# EAGLE design IMU_MCU_AUD_PT (EAGLE 6.5.0)

## Sheet 1 of 4
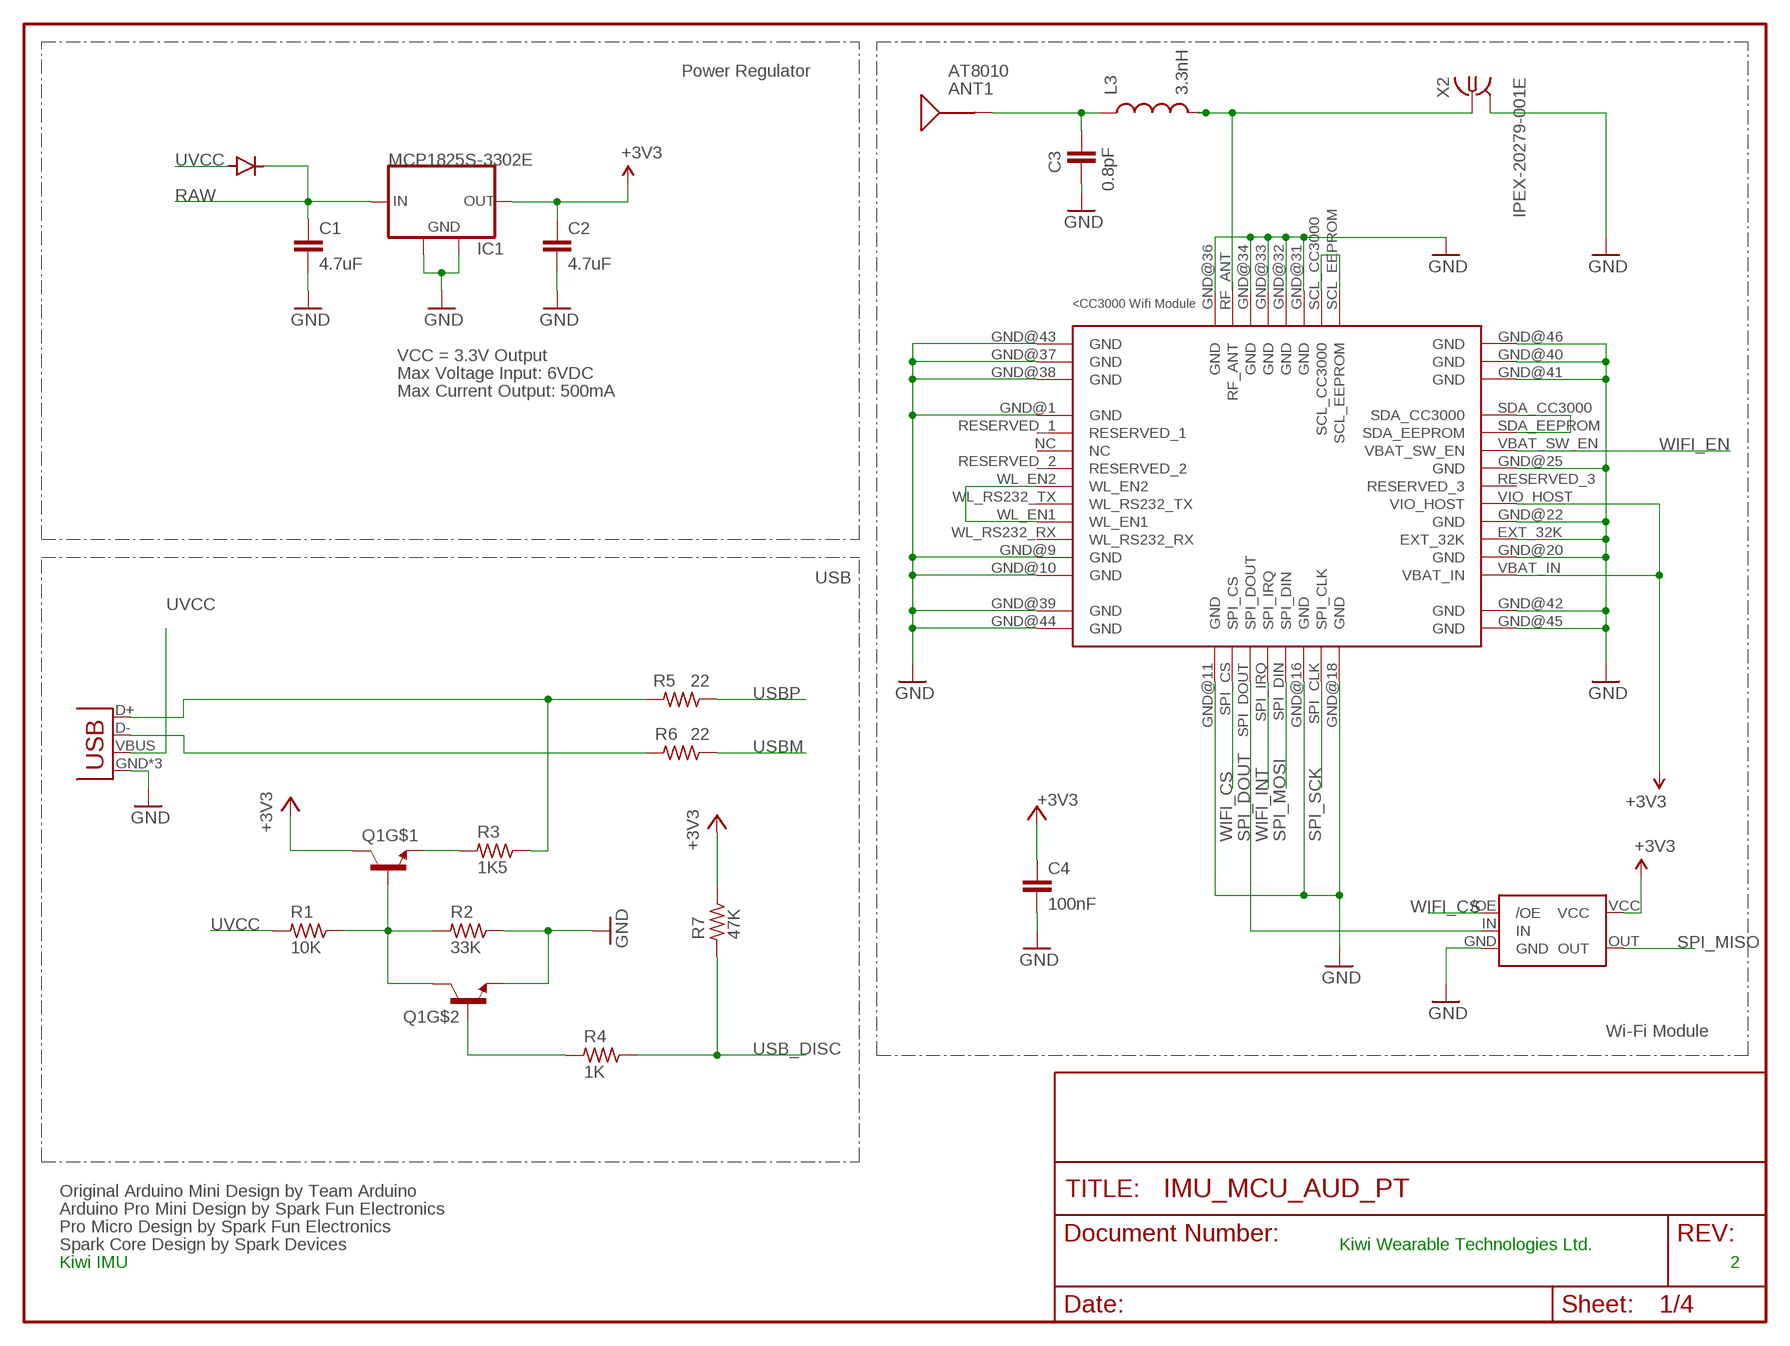
[diagram p0: schematic, sheet 1, part 1 of 2]
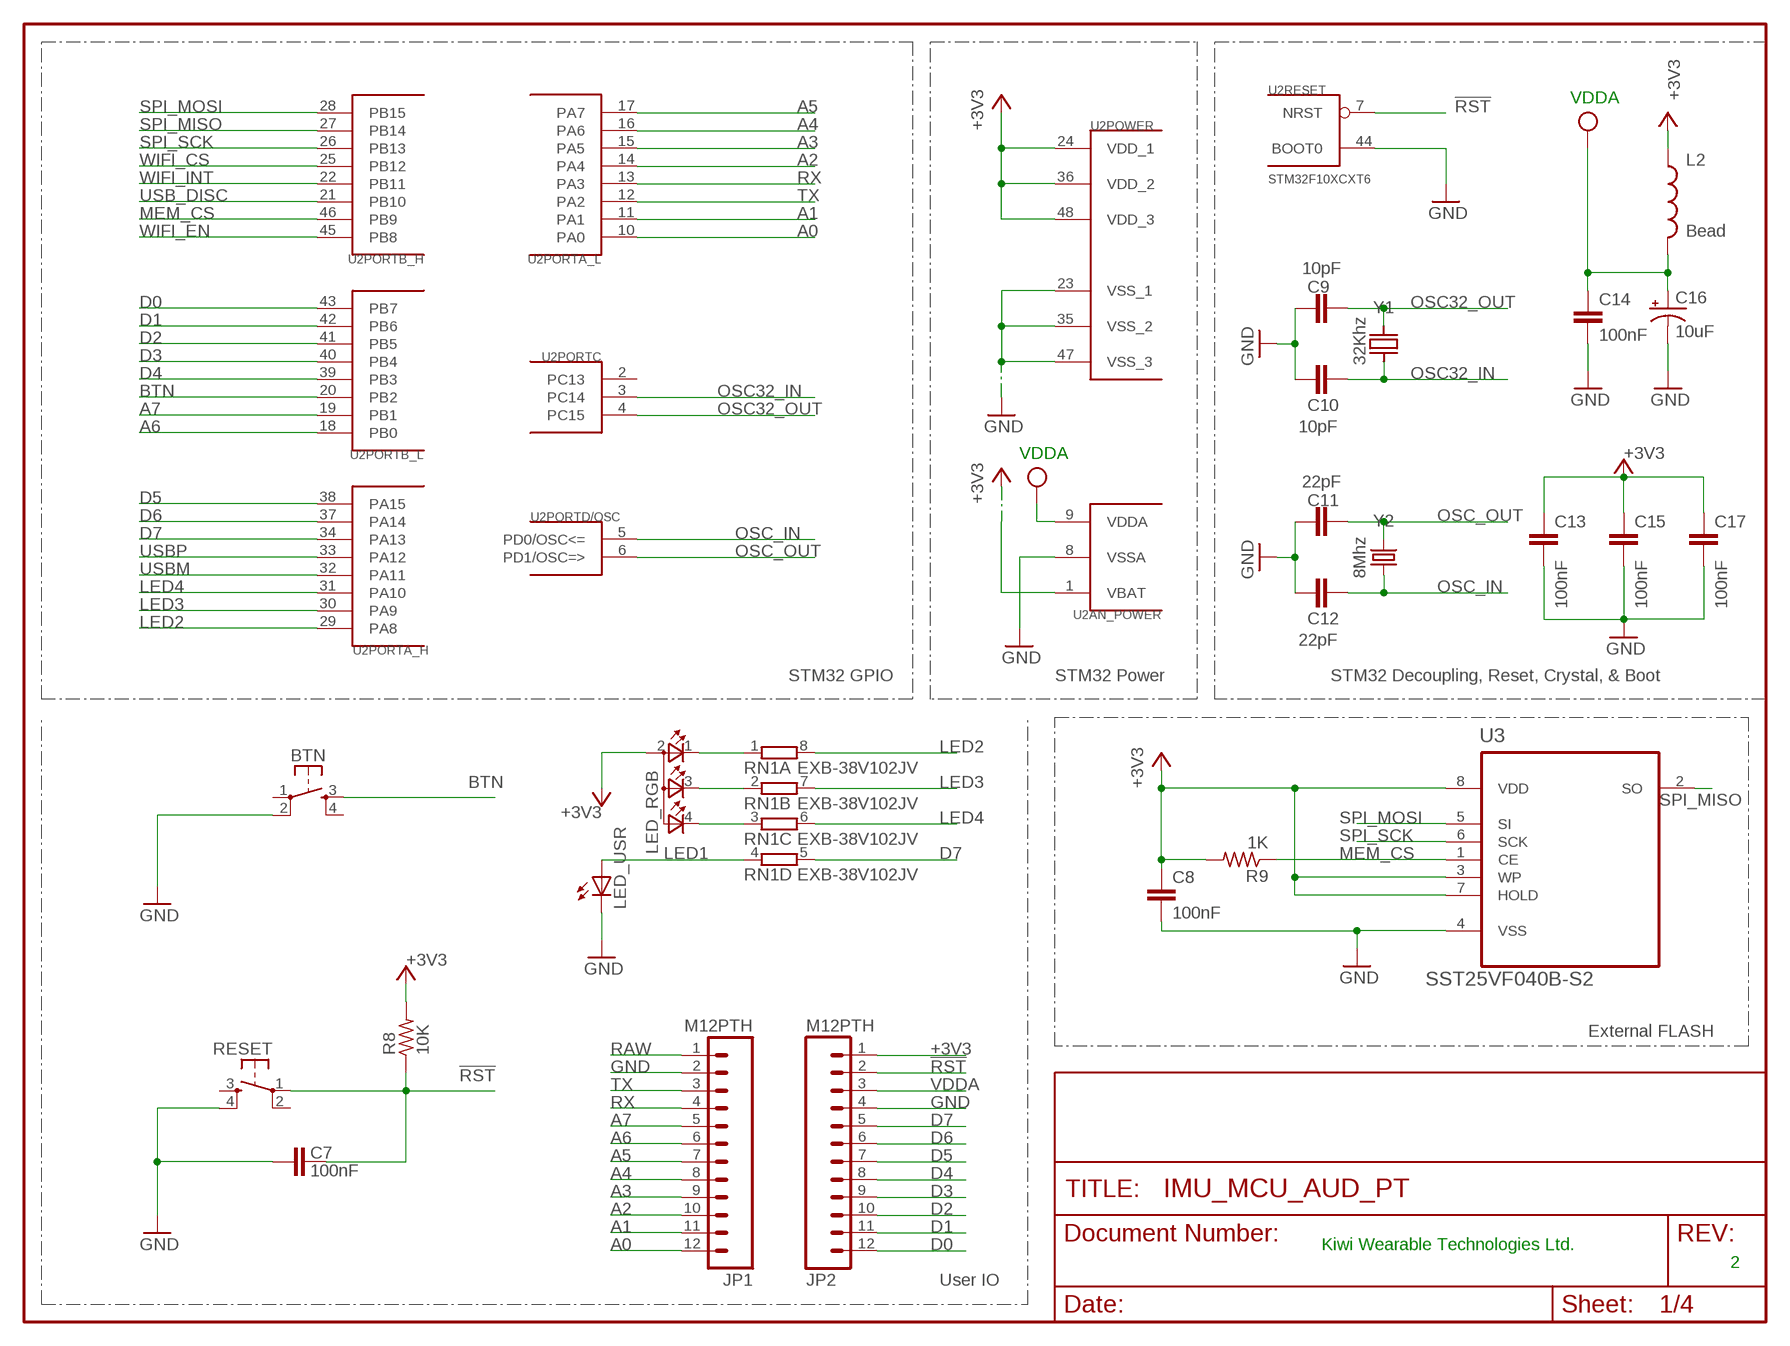
[diagram p1: schematic, sheet 1, part 2 of 2]

### Parts
ANT1  AT8010  [AT8010]
B1  NL17SZ125SOT553  [SOT-553]
BTN  KMR211GLFS  TAC_SWITCHSMD  [TACTILE_SWITCH_SMD]
C1  4.7uF  C-EUC0603  [C0603]
C2  4.7uF  C-EUC0603  [C0603]
C3  0.8pF  C-EUC0603  [C0603]
C4  100nF  C-EUC0603  [C0603]
C7  100nF  C-EUC0603  [C0603]
C8  100nF  C-EUC0603  [C0603]
C9  10pF  C-EUC0603  [C0603]
C10  10pF  C-EUC0603  [C0603]
C11  22pF  C-EUC0603  [C0603]
C12  22pF  C-EUC0603  [C0603]
C13  100nF  C-EUC0603  [C0603]
C14  100nF  C-EUC0603  [C0603]
C15  100nF  C-EUC0603  [C0603]
C16  10uF  TANT-CAP1206  [EIA3216]
C17  100nF  C-EUC0603  [C0603]
IC1  MCP1825S-3302E  MCP1825S-SOT223  [SOT223]
JP1  M12PTH  [1X12-SMALL-PADS]
JP2  M12PTH  [1X12-SMALL-PADS]
L2  Bead  INDUCTOR0603  [0603]
L3  3.3nH  INDUCTOR0603  [0603]
LED_RGB  TOPLED-3PLCC  [P-LCC-4-3]
LED_USR  LED0603  [LED-0603]
Q1  MMDT3904  [SOT363]
R1  10K  R-US_R0603  [R0603]
R2  33K  R-US_R0603  [R0603]
R3  1K5  R-US_R0603  [R0603]
R4  1K  R-US_R0603  [R0603]
R5  22  R-US_R0603  [R0603]
R6  22  R-US_R0603  [R0603]
R7  47K  R-US_R0603  [R0603]
R8  10K  R-US_R0603  [R0603]
R9  1K  R-US_R0603  [R0603]
RESET  KMR211GLFS  TAC_SWITCHSMD  [TACTILE_SWITCH_SMD]
RN1  EXB-38V102JV  4R-NEXB38V  [EXB38V]
U1  CC3000  [CC3000]
U2  STM32F10XCXT6  [TQFP48]
U3  SST25VF040B-S2  [SOIC127P790X216-8N]
U$3  DIODE  [DIODE-DO-220AA(SMP)]
X1  USB-MICROB  USBUSB-MICROB-SLOT-HOLE  [USB-MICROB-SLOT-HOLE]
X2  IPEX-20279-001E  [IPEX-20279-001E]
Y1  32Khz  Q_FC135  [FC135]
Y2  8Mhz  CRYSTAL5X3  [CRYSTAL-SMD-5X3]

### Nets
3.3V: B1.VCC ; supply symbol labelled +3V3
!RST: C7.2 JP2.2 R8.1 RESET.1 U2.7(RESET:NRST)
+3V3: C2.1 C4.1 C8.1 C13.1 C15.1 C17.1 IC1.3(OUT) JP2.1 L2.1 LED_RGB.2(A2) Q1.3(C) R7.1 R8.2 R9.2 U1.VBAT_IN U1.VIO_HOST U2.1(AN_POWER:VBAT) U2.24(POWER:VDD_1) U2.36(POWER:VDD_2) U2.48(POWER:VDD_3) U3.3(WP) U3.7(HOLD) U3.8(VDD) ; also sheet 2,3,4
A0: JP1.12 U2.10(PORTA_L:PA0) ; also sheet 3
A1: JP1.11 U2.11(PORTA_L:PA1) ; also sheet 3
A2: JP1.10 U2.14(PORTA_L:PA4)
A3: JP1.9 U2.15(PORTA_L:PA5)
A4: JP1.8 U2.16(PORTA_L:PA6)
A5: JP1.7 U2.17(PORTA_L:PA7)
A6: JP1.6 U2.18(PORTB_L:PB0) ; also sheet 2
A7: JP1.5 U2.19(PORTB_L:PB1)
BTN: BTN.3 U2.20(PORTB_L:PB2)
D0: JP2.12 U2.43(PORTB_L:PB7) ; also sheet 2
D1: JP2.11 U2.42(PORTB_L:PB6) ; also sheet 2
D2: JP2.10 U2.41(PORTB_L:PB5)
D3: JP2.9 U2.40(PORTB_L:PB4) ; also sheet 4
D4: JP2.8 U2.39(PORTB_L:PB3) ; also sheet 4
D5: JP2.7 U2.38(PORTA_H:PA15) ; also sheet 4
D6: JP2.6 U2.37(PORTA_H:PA14) ; also sheet 4
D7: JP2.5 RN1.5 U2.34(PORTA_H:PA13)
GND [vcc]: B1.GND BTN.2 C1.2 C2.2 C3.1 C4.2 C7.1 C8.2 C9.2 C10.2 C11.2 C12.2 C13.2 C14.2 C15.2 C16.C(-) C17.2 IC1.2(GND) IC1.4(GND) JP1.2 JP2.4 LED_USR.C Q1.1(E) R2.1 RESET.4 U1.EXT_32K U1.GND@1(GND) U1.GND@9(GND) U1.GND@10(GND) U1.GND@11(GND) U1.GND@16(GND) U1.GND@18(GND) U1.GND@20(GND) U1.GND@22(GND) U1.GND@25(GND) U1.GND@31(GND) U1.GND@32(GND) U1.GND@33(GND) U1.GND@34(GND) U1.GND@36(GND) U1.GND@37(GND) U1.GND@38(GND) U1.GND@39(GND) U1.GND@40(GND) U1.GND@41(GND) U1.GND@42(GND) U1.GND@43(GND) U1.GND@44(GND) U1.GND@45(GND) U1.GND@46(GND) U2.8(AN_POWER:VSSA) U2.23(POWER:VSS_1) U2.35(POWER:VSS_2) U2.44(RESET:BOOT0) U2.47(POWER:VSS_3) U3.4(VSS) X1.GND X1.MT1(GND) X1.MT2(GND) X2.2@1(GND) X2.2@2(GND) ; also sheet 2,3,4
LED1: LED_USR.A RN1.4
LED2: RN1.8 U2.29(PORTA_H:PA8)
LED3: RN1.7 U2.30(PORTA_H:PA9)
LED4: RN1.6 U2.31(PORTA_H:PA10)
MEM_CS: R9.1 U2.46(PORTB_H:PB9) U3.1(CE)
N$1: R3.1 R5.2 X1.D+
N$3 [RF]: ANT1.SIG(SIGNAL) C3.2 L3.1
N$4 [RF]: L3.2 U1.RF_ANT X2.1
N$6: R6.2 X1.D-
N$7: U1.SCL_CC3000 U1.SCL_EEPROM
N$8: Q1.2(B) R4.2
N$9: U1.WL_EN1 U1.WL_EN2
N$10: LED_RGB.1(CRED) RN1.1
N$12: LED_RGB.3(CBLUE) RN1.2
N$13: Q1.5(B) Q1.6(C) R1.1 R2.2
N$14: LED_RGB.4(CGREEN) RN1.3
N$15: U1.SDA_CC3000 U1.SDA_EEPROM
N$16: Q1.4(E) R3.2
OSC32_IN: C10.1 U2.3(PORTC:PC14) Y1.X1
OSC32_OUT: C9.1 U2.4(PORTC:PC15) Y1.X2
OSC_IN: C12.1 U2.5(PORTD/OSC:PD0/OSC<=) Y2.1
OSC_OUT: C11.1 U2.6(PORTD/OSC:PD1/OSC=>) Y2.3
RAW [vcc]: C1.1 IC1.1(IN) JP1.1 U$3.CATHODE
RX: JP1.4 U2.13(PORTA_L:PA3)
SPI_DOUT: B1.IN U1.SPI_DOUT
SPI_MISO: B1.OUT U2.27(PORTB_H:PB14) U3.2(SO)
SPI_MOSI: U1.SPI_DIN U2.28(PORTB_H:PB15) U3.5(SI)
SPI_SCK: U1.SPI_CLK U2.26(PORTB_H:PB13) U3.6(SCK)
TX: JP1.3 U2.12(PORTA_L:PA2)
USB_DISC: R4.1 R7.2 U2.21(PORTB_H:PB10)
USBM: R6.1 U2.32(PORTA_H:PA11)
USBP: R5.1 U2.33(PORTA_H:PA12)
UVCC: R1.2 U$3.ANODE X1.VBUS
VDDA: C14.1 C16.A(+) JP2.3 L2.2 U2.9(AN_POWER:VDDA) ; supply symbol labelled VCC
WIFI_CS: B1./OE U1.SPI_CS U2.25(PORTB_H:PB12)
WIFI_EN: U1.VBAT_SW_EN U2.45(PORTB_H:PB8)
WIFI_INT: U1.SPI_IRQ U2.22(PORTB_H:PB11)
Unconnected: BTN.1 BTN.4 RESET.2 RESET.3 U1.NC U1.RESERVED_1 U1.RESERVED_2 U1.RESERVED_3 U1.WL_RS232_RX U1.WL_RS232_TX U2.2(PORTC:PC13)

### Notes on the sheet
- Power Regulator
- VDDA
- VCC = 3.3V Output
- Max Voltage Input: 6VDC
- Max Current Output: 500mA
- VDDA
- USB
- STM32 GPIO | STM32 Power | STM32 Decoupling, Reset, Crystal, & Boot
- Wi-Fi Module | External FLASH
- Original Arduino Mini Design by Team Arduino
- Arduino Pro Mini Design by Spark Fun Electronics
- Pro Micro Design by Spark Fun Electronics
- Spark Core Design by Spark Devices | Kiwi Wearable Technologies Ltd. | Kiwi Wearable Technologies Ltd.
- Kiwi IMU | 2 | 2
- User IO

## Sheet 2 of 4
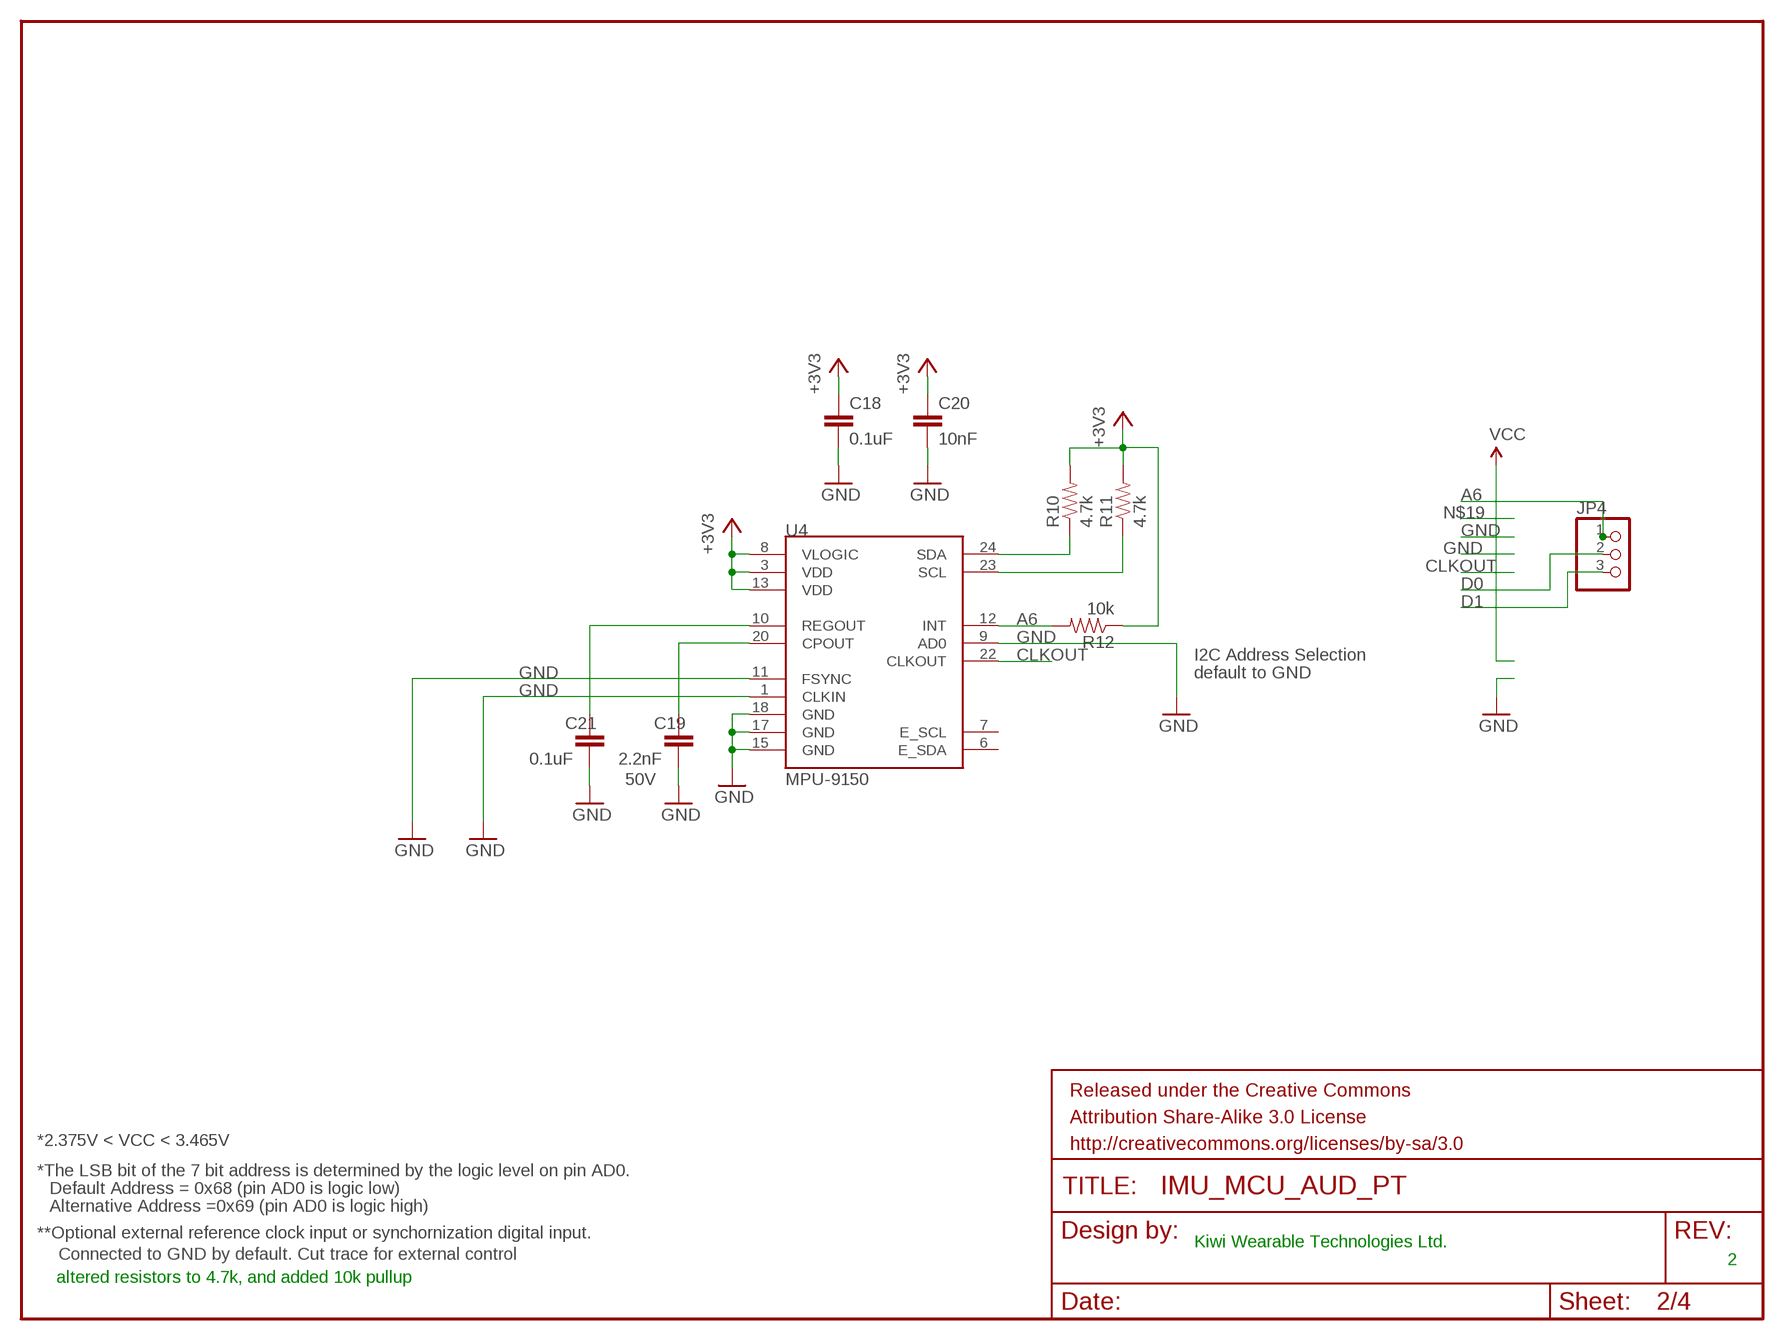
[diagram p2: schematic, sheet 2]

### Parts
C18  0.1uF  CAP0402-CAP  [0402-CAP]
C19  2.2nF  CAP0402-CAP  [0402-CAP]
C20  10nF  CAP0402-CAP  [0402-CAP]
C21  0.1uF  CAP0402-CAP  [0402-CAP]
JP4  PINHD-1X3  [1X03]
R10  4.7k  RESISTOR0402-RES  [0402-RES]
R11  4.7k  RESISTOR0402-RES  [0402-RES]
R12  10k  RESISTOR0402-RES  [0402-RES]
U4  MPU-9150  MPU-9150QFN-24-NP  [QFN-24-NP]

### Nets
+3V3: C18.1 C20.1 R10.2 R11.2 R12.1 U4.3(VDD) U4.8(VLOGIC) U4.13(VDD) ; also sheet 1,3,4
A6: JP4.1 R12.2 U4.12(INT) ; also sheet 1
CLKOUT: U4.22(CLKOUT)
D0: JP4.2 R10.1 U4.24(SDA) ; also sheet 1
D1: JP4.3 R11.1 U4.23(SCL) ; also sheet 1
GND [vcc]: C18.2 C19.2 C20.2 C21.2 U4.1(CLKIN) U4.9(AD0) U4.11(FSYNC) U4.15(GND) U4.17(GND) U4.18(GND) ; also sheet 1,3,4
N$17: C19.1 U4.20(CPOUT)
N$18: C21.1 U4.10(REGOUT)
Unconnected: U4.6(E_SDA) U4.7(E_SCL)

### Notes on the sheet
- I2C Address Selection
- default to GND
- 50V
- *2.375V < VCC < 3.465V
- *The LSB bit of the 7 bit address is determined by the logic level on pin AD0.
- Default Address = 0x68 (pin AD0 is logic low)
- Alternative Address =0x69 (pin AD0 is logic high)
- **Optional external reference clock input or synchornization digital input.
- Kiwi Wearable Technologies Ltd.
- Connected to GND by default. Cut trace for external control
- 2
- altered resistors to 4.7k, and added 10k pullup

## Sheet 3 of 4
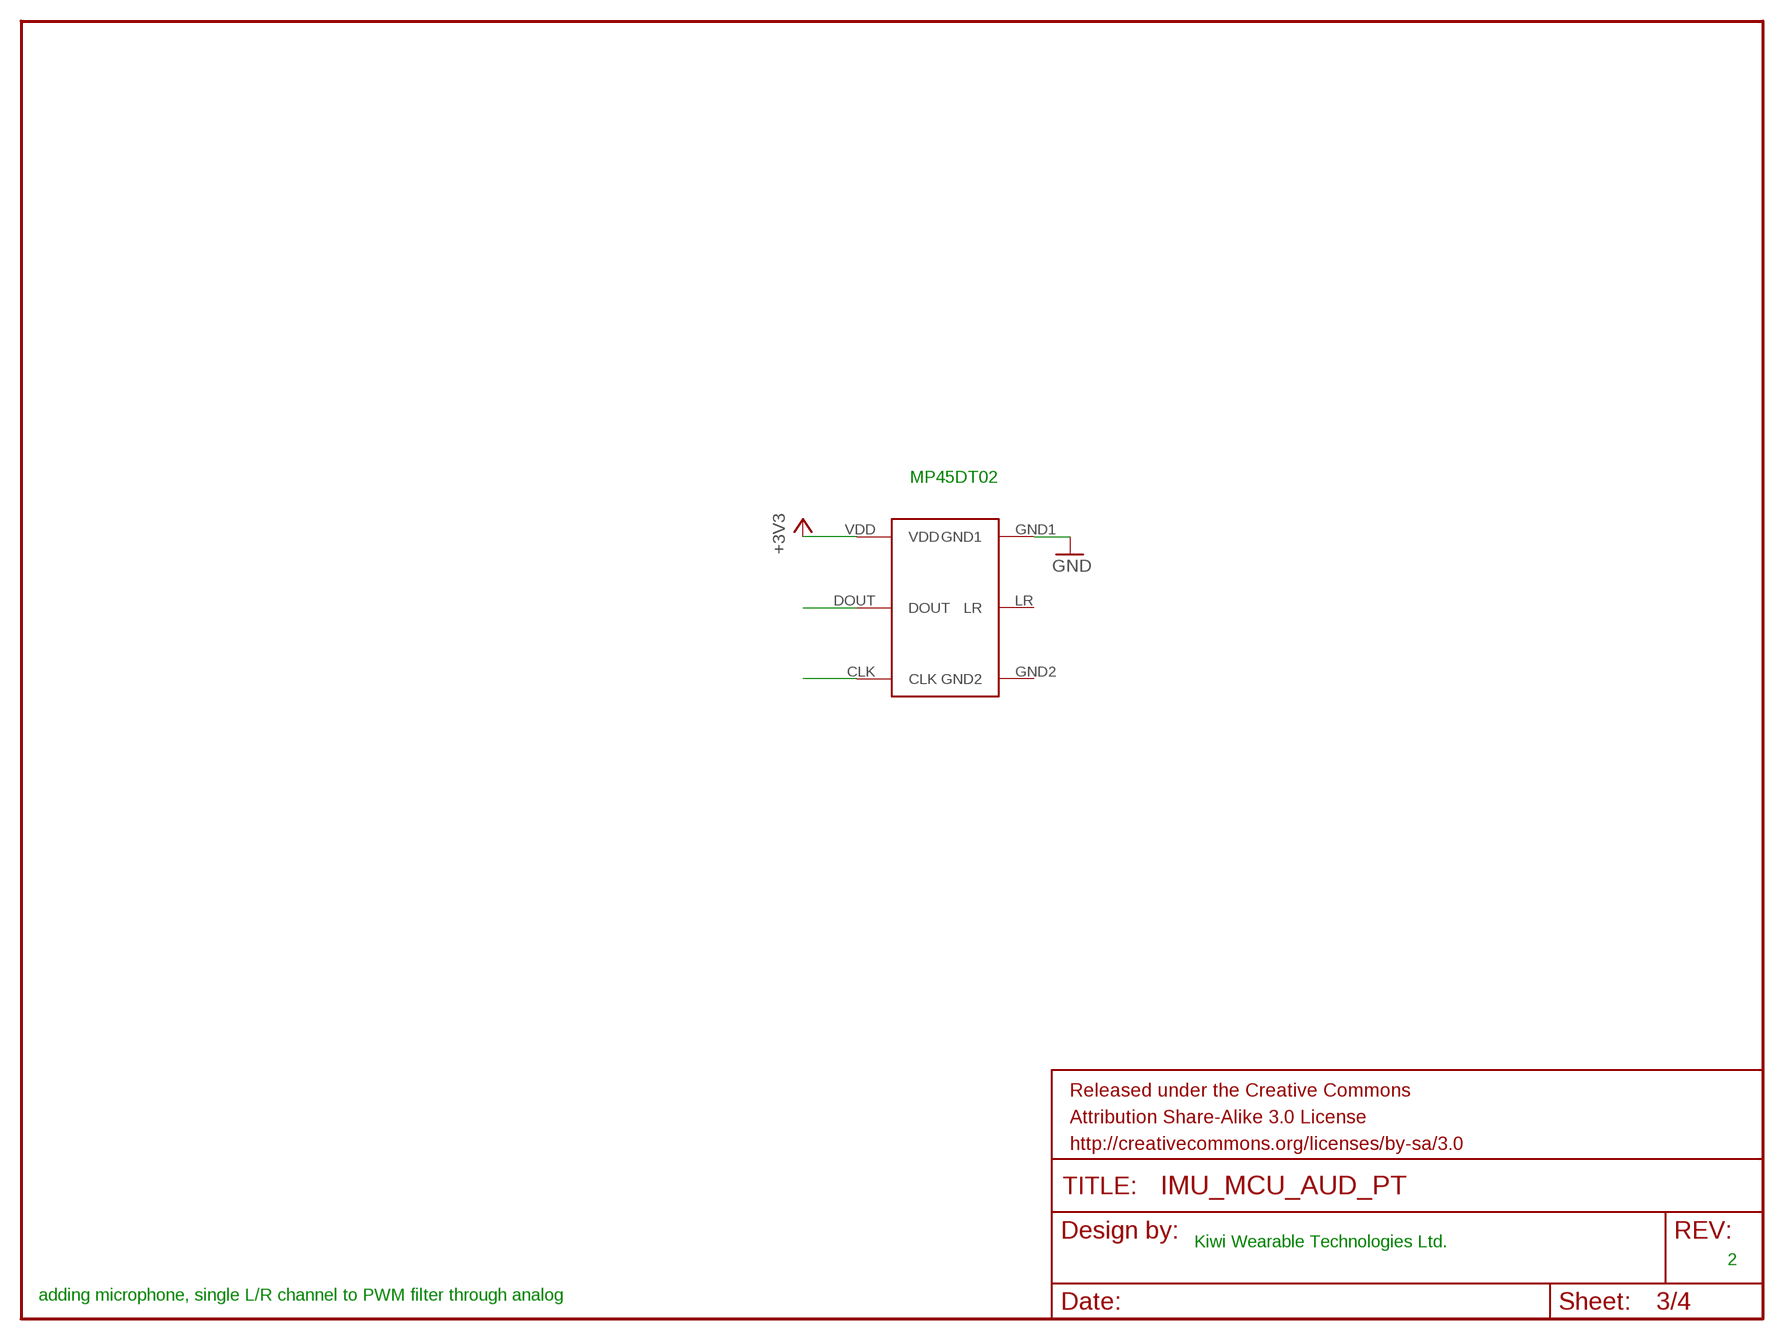
[diagram p3: schematic, sheet 3]

### Parts
M1  MP45DT02  [HLGA]

### Nets
+3V3: M1.VDD ; also sheet 1,2,4
A0: M1.CLK ; also sheet 1
A1: M1.DOUT ; also sheet 1
GND [vcc]: M1.GND1 ; also sheet 1,2,4
Unconnected: M1.GND2 M1.LR

### Notes on the sheet
- MP45DT02
- Kiwi Wearable Technologies Ltd.
- 2
- adding microphone, single L/R channel to PWM filter through analog

## Sheet 4 of 4
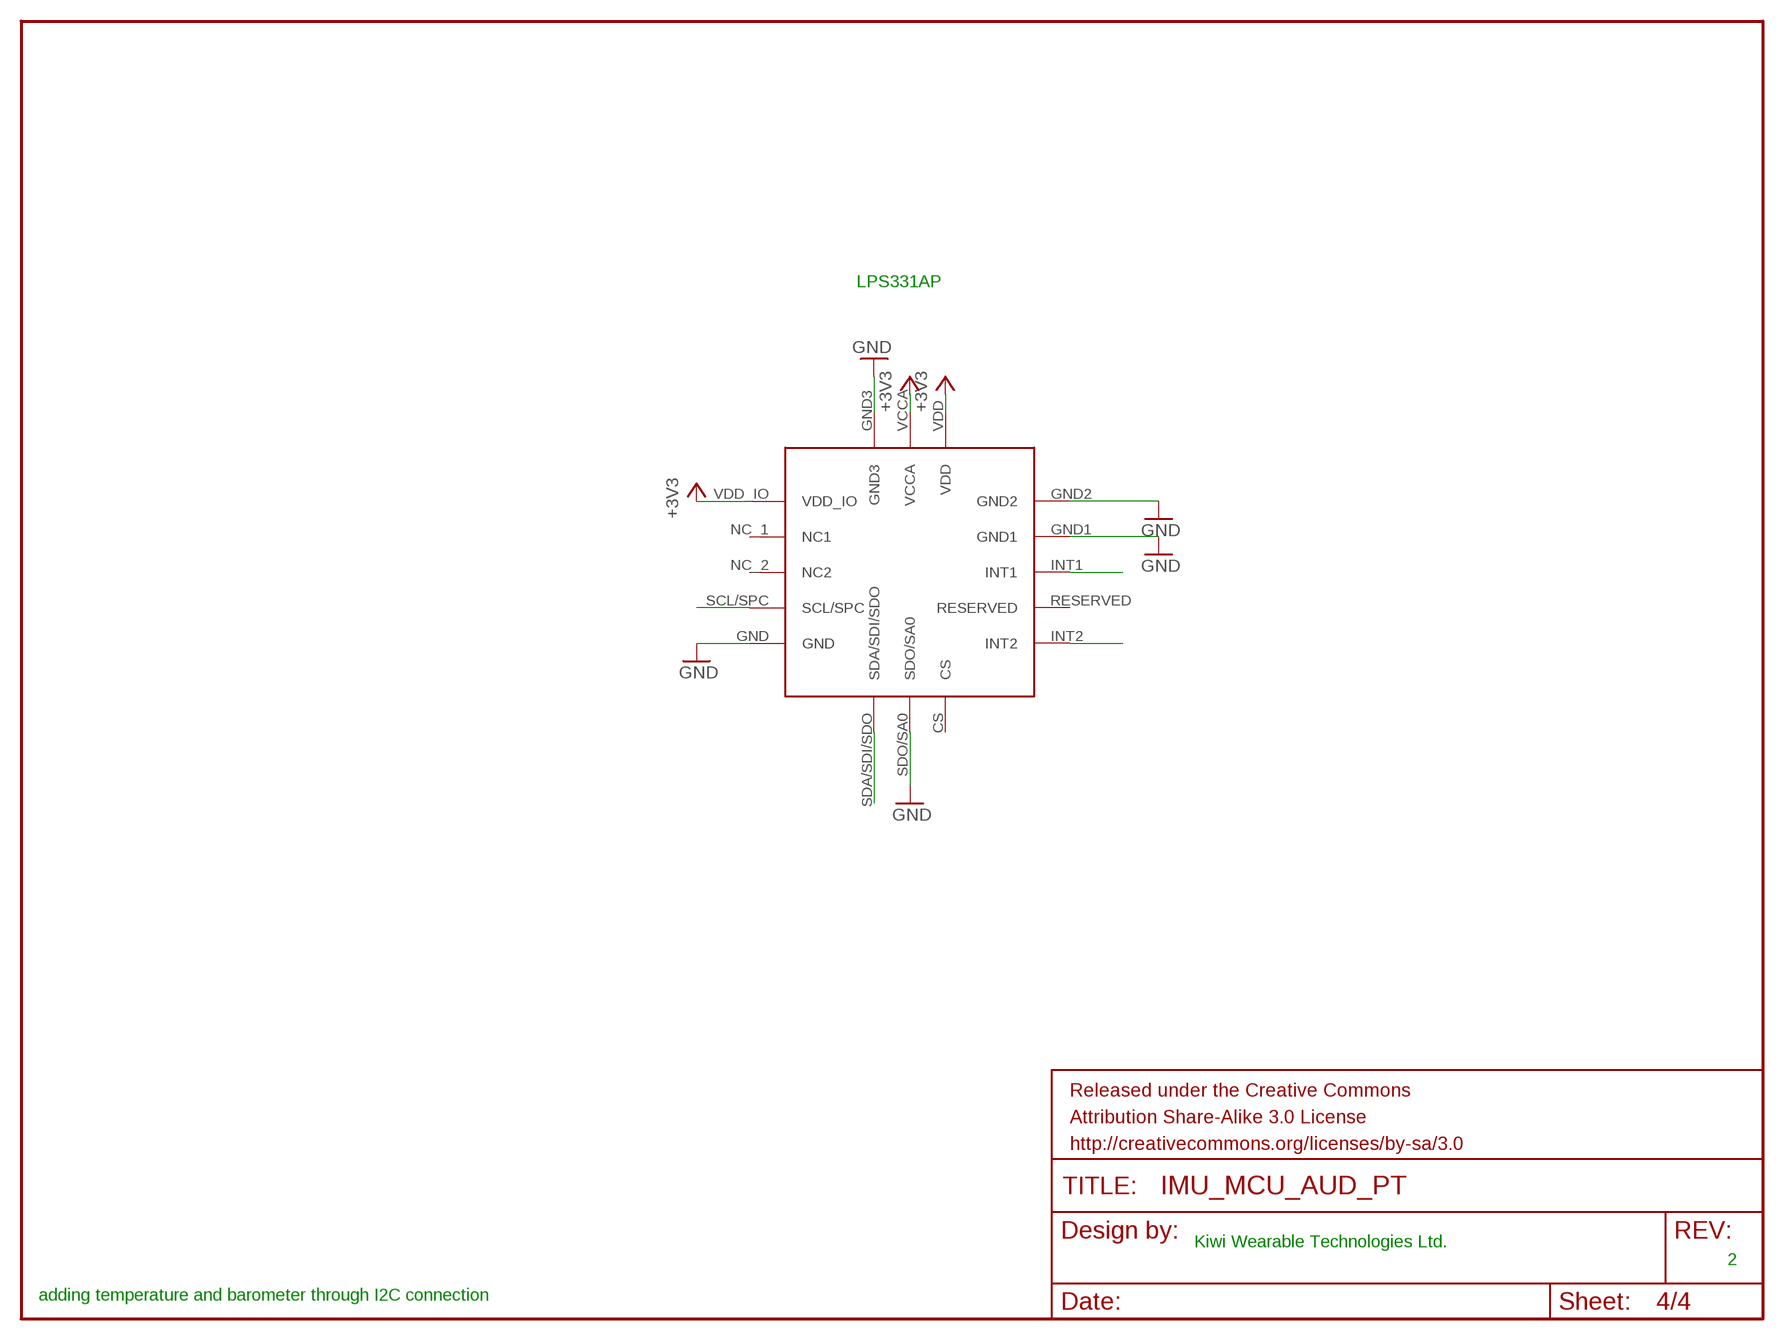
[diagram p4: schematic, sheet 4]

### Parts
P1  LPS331AP  [HCLGA]

### Nets
+3V3: P1.VCCA P1.VDD P1.VDD_IO ; also sheet 1,2,3
D3: P1.INT1 ; also sheet 1
D4: P1.INT2 ; also sheet 1
D5: P1.SCL/SPC ; also sheet 1
D6: P1.SDA/SDI/SDO ; also sheet 1
GND [vcc]: P1.GND P1.GND1 P1.GND2 P1.GND3 P1.SDO/SA0 ; also sheet 1,2,3
Unconnected: P1.CS P1.NC_1(NC1) P1.NC_2(NC2) P1.RESERVED

### Notes on the sheet
- LPS331AP
- Kiwi Wearable Technologies Ltd.
- 2
- adding temperature and barometer through I2C connection

## Library data of the parts
ANT1 = Spark:AT8010: AT8010 Series Multilayer Chip Antenna
B1 = Spark:NL17SZ125
BTN RESET = Spark:TAC_SWITCH: SMD Tactiile Switch
C1-C4 C7-C15 C17 = rcl:C-EU: CAPACITOR, European symbol
C16 = Spark:TANT-CAP: Tantalum SMT
C18-C21 = SparkFun-Passives:CAP: Capacitor Standard 0603 ceramic capacitor, and 0.1" leaded capacitor.
IC1 = Spark:MCP1825S: 500 mA, Low Voltage, Low Quiescent Current LDO Regulator
JP1 JP2 = Spark:M12: Header 12 Standard 12-pin 0.1" header. Use with straight break away headers (SKU : PRT-00116), right angle break away headers (PRT-00553), swiss pins (PRT-00743), machine pins (PRT-00117), and female headers (PRT-00115).
JP4 = adafruit:PINHD-1X3: PIN HEADER
L2 L3 = SparkFun-Passives:INDUCTOR: Inductors Basic Inductor/Choke - 0603 and 1206. Footprints are not proven and vary greatly between part numbers. SRN6045- 33uH, 20% 1.4A
LED_RGB = Spark:TOPLED-3: Cree CLVBA-FKA
LED_USR = SparkFun:LED: LEDs Standard schematic elements and footprints for 5mm, 3mm, 1206, and 0603 sized LEDs. 5mm - Spark Fun Electronics SKU : COM-00529 (and others)
M1 = mp45dt02:MP45DT02
P1 = LPS_PRESSURE:LPS331AP
Q1 = SparkFun-DiscreteSemi:MMDT3904: Dual NPN transistor
R1-R9 = rcl:R-US_: RESISTOR, American symbol
R10-R12 = SparkFun-Passives:RESISTOR: Resistor Basic schematic elements and footprints for 0603, 1206, and PTH resistors.
RN1 = resistor-dil:4R-N: Array Chip Resistor Source: RS Component / Phycomp; OC_FARNELL: unknown; OC_NEWARK: unknown
U1 = CC3000:CC3000
U2 = stm32:STM32F10XCXT6: ST STM32F101/103 48pin LQFP
U3 = Spark:SST25VF040B: 4 Mbit SPI Serial Flash
U4 = SparkFun-Sensors:MPU-9150: 9DOF (3mag, 3accel, 3rotat). I2C interface.
U$3 = Spark:DIODE
X1 = Spark:USB
X2 = Spark:IPEX-20279-001E: Ultra Miniature Coaxial SMT RF Receptacle
Y1 = Spark:Q
Y2 = SparkFun-FreqCtrl:CRYSTAL: Various standard crystals. Proven footprints. Spark Fun Electronics SKU : COM-00534

## Net classes
2 RF: width 0.635 mm, clearance 0.762 mm

## Board
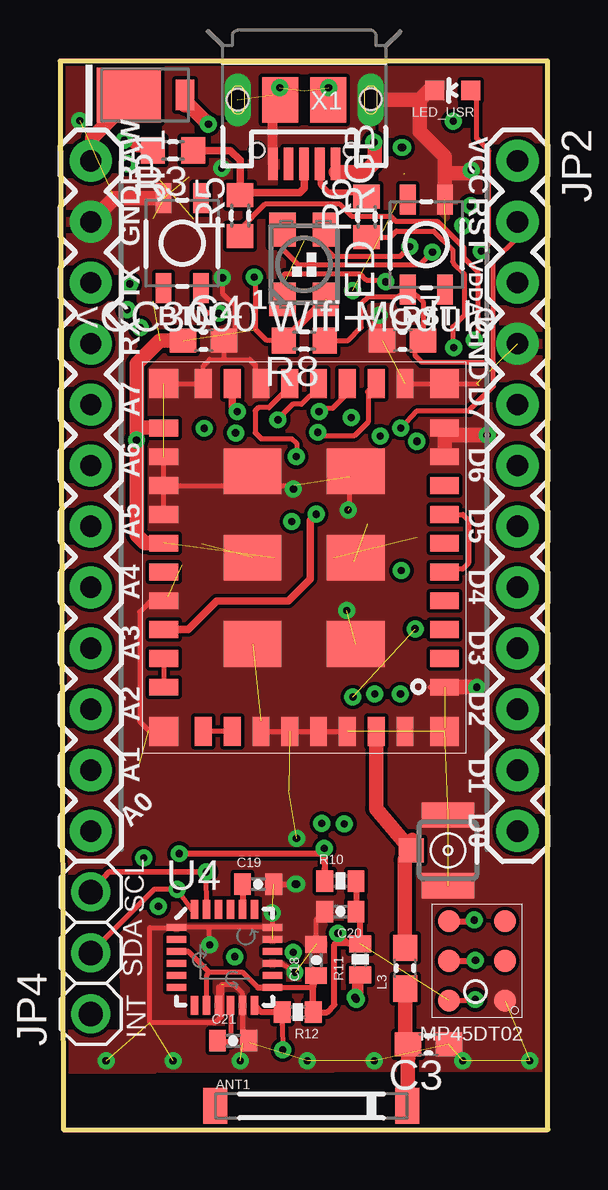
[diagram p5: board, top side]
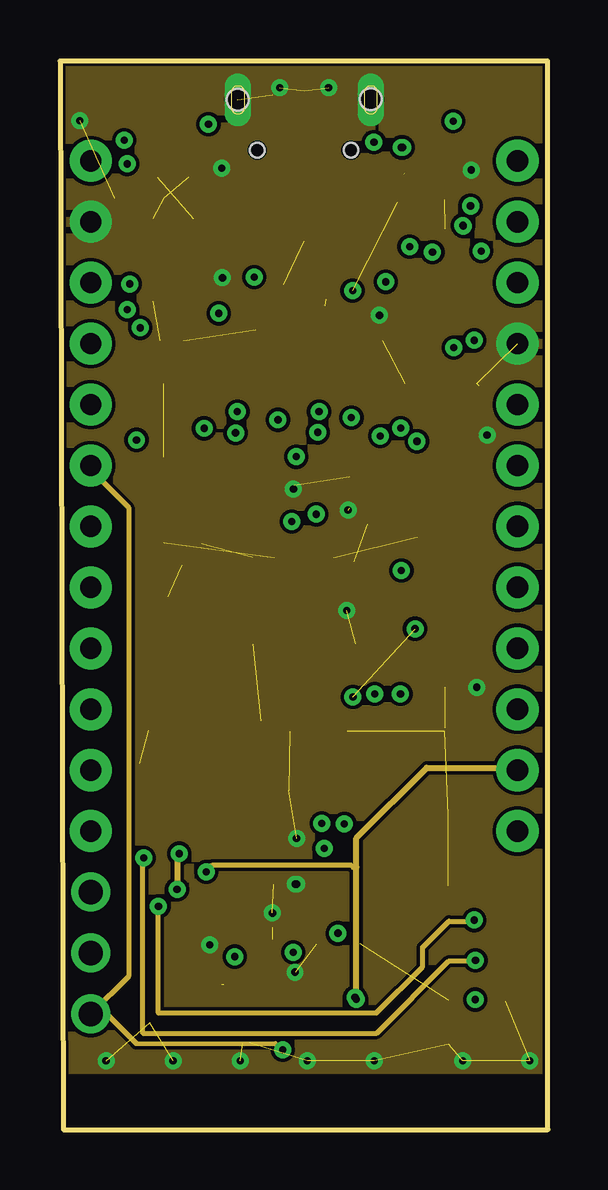
[diagram p6: board, inner layer $GND]
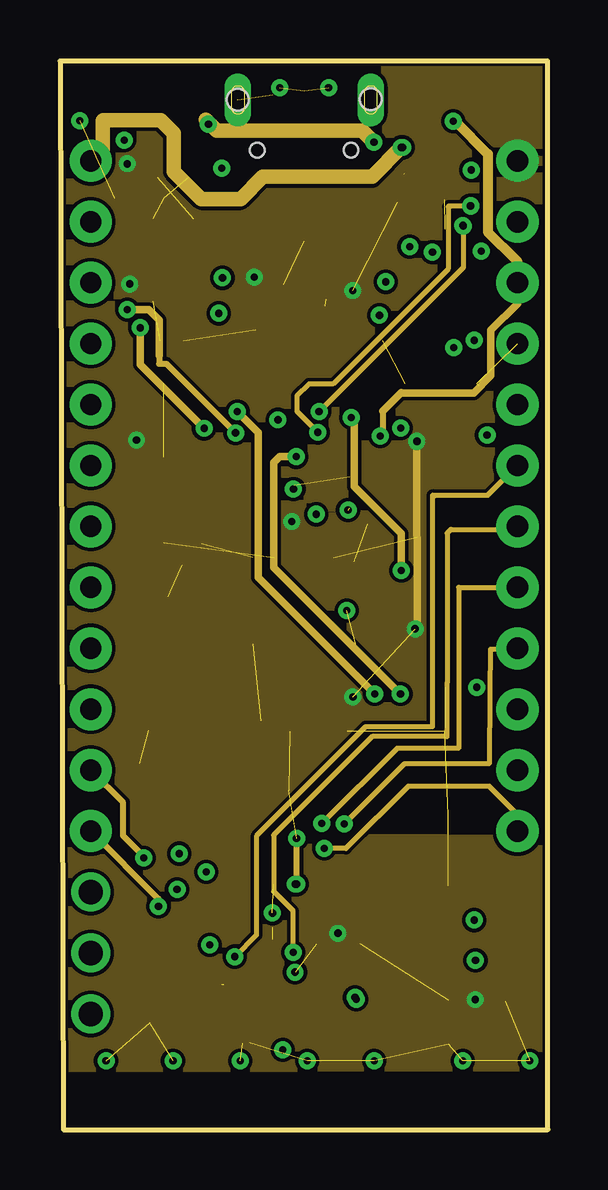
[diagram p7: board, inner layer $+3V3]
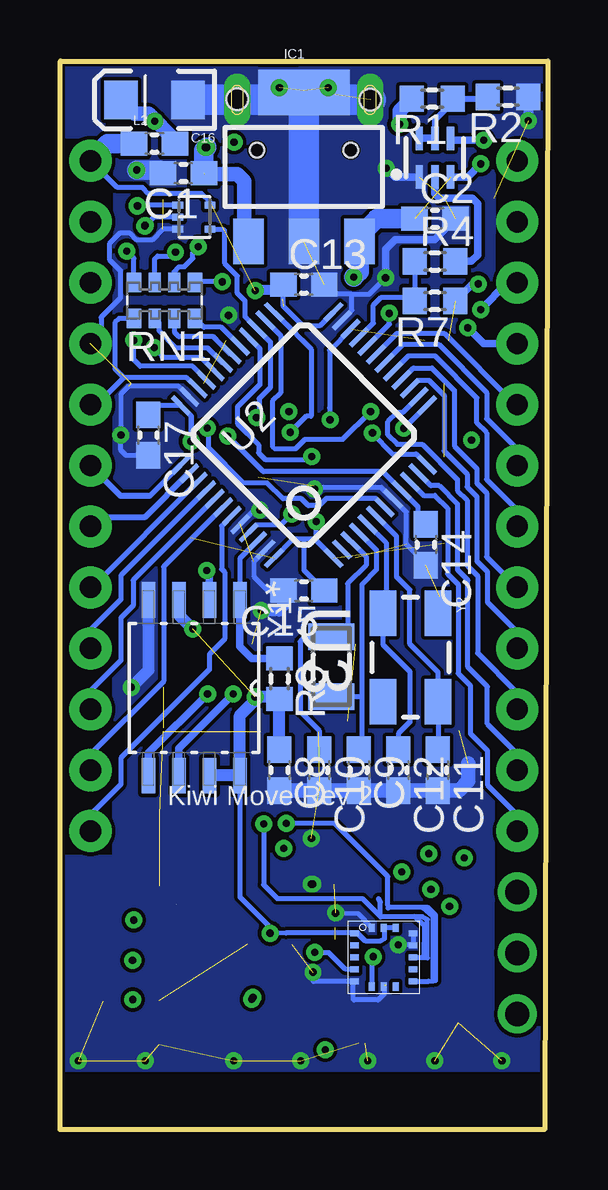
[diagram p8: board, bottom side, seen from below]

Size 20.33 x 44.54 mm. Coordinates in mm from the lower left corner, seen from the top.
Outline: 0,44.54 0.14,0 20.33,0 20.32,44.54 0,44.54
Copper layers (1+2*15+16): Top 0.035mm / dielectric 1.5mm / $GND 0.035mm / dielectric 0.15mm / $+3V3 0.035mm / dielectric 0.2mm / Bottom 0.035mm
Design rules "spark *": minimum track width 6mil, minimum drill 0.3mm, track to track 6mil, track to pad 6mil, pad to pad 6mil, via to via 6mil, smd to smd 6mil, copper to edge 4mil, drill to drill 6mil, minimum pad ring 12mil, minimum via ring 8mil, stop-mask expansion 4mil, vias tented up to drill 20mil, thermal gap 0mil
Holes 0.9 mm at 12.95,42.95 7.4,42.94

### Footprints (pad centres in the part's own frame; a part is rotated, then mirrored left to right if it is on the bottom)
AT8010 = smd 1 x 1.5: NC -4,0; SIG 4,0
SOT-553 = smd 0.3 x 0.45: /OE -0.5,0; GND 0.5,0; IN 0,0; OUT 0.5,1.35; VCC -0.5,1.35
TACTILE_SWITCH_SMD = smd 1.25 x 0.65: 1 -1.875,0.775; 2 1.875,0.775; 3 -1.875,-0.775; 4 1.875,-0.775
C0603 = smd 1.1 x 1: 1 -0.85,0; 2 0.85,0
EIA3216 = smd 1.4 x 1.6: A 1.4,0; C -1.4,0
0402-CAP = smd 0.7 x 0.9: 1 -0.65,0; 2 0.65,0
SOT223 = smd 1.27 x 1.905: 1 -2.311,-3.099; 2 0,-3.099; 3 2.311,-3.099 | smd 3.81 x 1.905: 4 0,3.099
1X12-SMALL-PADS = drill 0.889 pad 1.753: 1 0,0; 2 2.54,0; 3 5.08,0; 4 7.62,0; 5 10.16,0; 6 12.7,0; 7 15.24,0; 8 17.78,0; 9 20.32,0; 10 22.86,0; 11 25.4,0; 12 27.94,0
1X03 = drill 1.016: 1 -2.54,0; 2 0,0; 3 2.54,0
0603 = smd 1.1 x 1: 1 -0.85,0; 2 0.85,0
P-LCC-4-3 = smd 1.1 x 1.4: 1 -0.9,-1.45; 2 0.9,-1.45; 3 0.9,1.45; 4 -0.9,1.45
LED-0603 = smd 0.8 x 0.8: A 0,-0.75; C 0,0.75
HLGA = smd 0.91 x 0.91: CLK 3.105,0.71; DOUT 3.1,2.36; GND1 0.76,4.01; GND2 0.76,0.71; LR 0.76,2.36; VDD 3.1,4.01
HCLGA = smd 0.25 x 0.35: CS 2,0.275; GND3 1,2.725; SDA/SDI/SDO 1,0.275; SDO/SA0 1.5,0.275; VCCA 1.5,2.725; VDD 2,2.725 | smd 0.35 x 0.25: GND 0.275,0.5; GND1 2.725,2; GND2 2.725,2.5; INT1 2.725,1.5; INT2 2.725,0.5; NC_1 0.275,2; NC_2 0.275,1.5; RESERVED 2.725,1; SCL/SPC 0.275,1; VDD_IO 0.275,2.5
SOT363 = smd 0.3 x 0.99: 1 -0.65,-0.8; 2 0,-0.8; 3 0.65,-0.8; 4 0.65,0.81; 5 0,0.81; 6 -0.65,0.81
R0603 = smd 1 x 1.1: 1 -0.85,0; 2 0.85,0
0402-RES = smd 0.7 x 0.9: 1 -0.65,0; 2 0.65,0
EXB38V = smd 0.6 x 0.8: 1 -1.275,-0.75; 4 1.275,-0.75; 5 1.275,0.75; 8 -1.275,0.75 | smd 0.5 x 0.8: 2 -0.4,-0.75; 3 0.4,-0.75; 6 0.4,0.75; 7 -0.4,0.75
CC3000 = smd 1.2 x 0.7: EXT_32K 5.85,-2.97; GND@1 -5.85,5.43; GND@9 -5.85,-4.17; GND@10 -5.85,-5.37; GND@20 5.85,-4.17; GND@22 5.85,-1.77; GND@25 5.85,1.83; NC -5.85,3.03; RESERVED_1 -5.85,4.23; RESERVED_2 -5.85,1.83; RESERVED_3 5.85,0.63; SDA_CC3000 5.85,5.43; SDA_EEPROM 5.85,4.23; VBAT_IN 5.85,-5.37; VBAT_SW_EN 5.85,3.03; VIO_HOST 5.85,-0.57; WL_EN1 -5.85,-1.77; WL_EN2 -5.85,0.63; WL_RS232_RX -5.85,-2.97; WL_RS232_TX -5.85,-0.57 | smd 0.7 x 1.2: GND@11 -4.2,-7.22; GND@16 1.8,-7.22; GND@18 4.2,-7.22; GND@31 1.8,7.28; GND@32 0.6,7.28; GND@33 -0.6,7.28; GND@34 -1.8,7.28; GND@36 -4.2,7.28; RF_ANT -3,7.28; SCL_CC3000 3,7.28; SCL_EEPROM 4.2,7.28; SPI_CLK 3,-7.22; SPI_CS -3,-7.22; SPI_DIN 0.6,-7.22; SPI_DOUT -1.8,-7.22; SPI_IRQ -0.6,-7.22 | smd 2.4 x 1.9: GND@37 -2.15,3.63; GND@38 -2.15,0.03; GND@39 -2.15,-3.57; GND@40 2.15,3.63; GND@41 2.15,0.03; GND@42 2.15,-3.57 | smd 1.2 x 1.2: GND@43 -5.85,7.28; GND@44 -5.85,-7.22; GND@45 5.85,-7.22; GND@46 5.85,7.28
TQFP48 = smd 0.2 x 1: 1 -2.75,-4.5; 2 -2.25,-4.5; 3 -1.75,-4.5; 4 -1.25,-4.5; 5 -0.75,-4.5; 6 -0.25,-4.5; 7 0.25,-4.5; 8 0.75,-4.5; 9 1.25,-4.5; 10 1.75,-4.5; 11 2.25,-4.5; 12 2.75,-4.5; 25 2.75,4.5; 26 2.25,4.5; 27 1.75,4.5; 28 1.25,4.5; 29 0.75,4.5; 30 0.25,4.5; 31 -0.25,4.5; 32 -0.75,4.5; 33 -1.25,4.5; 34 -1.75,4.5; 35 -2.25,4.5; 36 -2.75,4.5 | smd 1 x 0.2: 13 4.5,-2.75; 14 4.5,-2.25; 15 4.5,-1.75; 16 4.5,-1.25; 17 4.5,-0.75; 18 4.5,-0.25; 19 4.5,0.25; 20 4.5,0.75; 21 4.5,1.25; 22 4.5,1.75; 23 4.5,2.25; 24 4.5,2.75; 37 -4.5,2.75; 38 -4.5,2.25; 39 -4.5,1.75; 40 -4.5,1.25; 41 -4.5,0.75; 42 -4.5,0.25; 43 -4.5,-0.25; 44 -4.5,-0.75; 45 -4.5,-1.25; 46 -4.5,-1.75; 47 -4.5,-2.25; 48 -4.5,-2.75
SOIC127P790X216-8N = smd 1.499 x 0.559: 1 -3.658,1.905; 2 -3.658,0.635; 3 -3.658,-0.635; 4 -3.658,-1.905; 5 3.658,-1.905; 6 3.658,-0.635; 7 3.658,0.635; 8 3.658,1.905
QFN-24-NP = smd 0.8 x 0.3: 1 -2,1.25; 2 -2,0.75; 3 -2,0.25; 4 -2,-0.25; 5 -2,-0.75; 6 -2,-1.25; 13 2,-1.25; 14 2,-0.75; 15 2,-0.25; 16 2,0.25; 17 2,0.75; 18 2,1.25 | smd 0.3 x 0.8: 7 -1.25,-2; 8 -0.75,-2; 9 -0.25,-2; 10 0.25,-2; 11 0.75,-2; 12 1.25,-2; 19 1.25,2; 20 0.75,2; 21 0.25,2; 22 -0.25,2; 23 -0.75,2; 24 -1.25,2
DIODE-DO-220AA(SMP) = smd 0.762 x 1.27: ANODE 2.349,0 | smd 2.667 x 2.286: CATHODE 0,0
USB-MICROB-SLOT-HOLE = smd 0.4 x 1.35: D+ 0,2.675; D- -0.65,2.675; GND 1.3,2.675; ID 0.65,2.675; VBUS -1.3,2.675 | drill 0.5 pad 1.1 long: MT1 -2.775,0; MT2 2.775,0 | smd 1.5 x 1.9: P$1 -1,0; P$2 1,0.01 | hole 0.6: -1.95,2.1; 1.95,2.1
IPEX-20279-001E = smd 1 x 1.05: 1 0,1.528 | smd 1.05 x 2.2: 2@1 -1.475,0; 2@2 1.475,0
FC135 = smd 1.1 x 1.9: X1 -1.25,0; X2 1.25,0
CRYSTAL-SMD-5X3 = smd 1.9 x 1.1: 1 -1.85,-1.15; 2 1.85,-1.15; 3 1.85,1.15; 4 -1.85,1.15

### Placement (x,y rotation side)
ANT1  10.48,0.99 0 top
B1  15.43,38.04 270 bottom
BTN  5.09,36.96 90 top
C1  15.19,39.88 180 bottom
C2  4.71,37.97 0 bottom
C3  15.35,3.56 180 top
C4  5.98,32.89 0 top
C7  14.27,32.89 0 top
C8  11.19,14.99 270 bottom
C9  7.89,14.99 270 bottom
C10  9.54,14.99 270 bottom
C11  4.58,14.99 270 bottom
C12  6.24,14.99 270 bottom
C13  10.17,35.23 0 bottom
C14  5.09,24.38 270 bottom
C15  10.17,22.48 180 bottom
C16  16.4,42.93 180 bottom
C17  16.65,28.96 270 bottom
C18  10.67,7.07 90 top
C19  8.26,10.24 0 top
C20  11.68,9.09 180 top
C21  7.21,3.71 0 top
IC1  10.17,40.13 0 bottom
JP1  1.28,40.39 270 top
JP2  19.06,40.39 270 top
JP4  1.28,7.37 90 top
L2  16.4,41.11 0 bottom
L3  14.38,6.73 90 top
LED_RGB  10.17,36.07 0 top
LED_USR  16.37,43.32 90 top
M1  19.3,9.4 180 top
P1  8.34,5.69 0 bottom
Q1  4.71,40.51 0 bottom
R1  4.83,42.98 180 bottom
R2  1.66,43.05 180 bottom
R3  4.71,40.82 180 top
R4  4.71,36.2 0 bottom
R5  7.51,38.1 90 top
R6  12.78,38.05 90 top
R7  4.71,34.54 180 bottom
R8  10.17,32.89 180 top
R9  11.19,18.8 270 bottom
R10  11.68,10.36 0 top
R11  12.51,7.1 90 top
R12  9.91,4.9 180 top
RESET  15.27,36.89 90 top
RN1  15.98,34.57 180 bottom
U1  10.17,23.88 180 top
U2  10.17,28.96 45 bottom
U3  14.74,18.41 270 bottom
U4  6.86,7.19 0 top
U$3  2.86,43.13 0 top
X1  10.17,42.93 180 top
X2  16.17,11.65 90 top
Y1  9.03,19.3 270 bottom
Y2  5.73,19.69 270 bottom

### Tracks (layer width: path | path; a pad name or v marks a point on that pad's centre or on a via)
!RST  (via drill 0.3)
  Top 0.203: R8.1 12,32.89 12.56,33.45 12.56,34.45 12.84,34.73 14.08,34.73 RESET.1 14.58,35.06 15.15,34.49 15.15,32.96 C7.2 14.78,32.89 14.78,32.28 15.07,31.99 18.06,31.99 | JP2.2 19.06,37.21 18.06,36.21 18.06,31.99 | v14.2,29.25 14.85,29.95 17.02,29.95 18.06,30.99 18.06,31.99
  Bottom 0.203: U2.7 7.18,26.31 9.23,26.31 9.54,26.01 9.98,26.01 10.27,26.3 11.05,26.3 11.71,26.96 12.69,26.96 14.13,28.41 14.13,29.19 v14.2,29.25
+3V3  (via drill 0.3)  (9 unrouted)
  Top 0.203: R8.2 8.62,32.89 8.17,33.35 8.17,35.46 v8.09,35.54 | 10.54,5.92 8.88,5.92 | 8.25,5.92 7.62,6.55 6.22,6.55 | 6.22,6.55 6.1,6.43 6.1,5.2 | U4.3 5.34,7.44 6.22,6.55 | M1.VDD 17.24,5.39 v17.3,5.42
  Top 0.254: C18.1 10.54,5.92 | 10.54,5.92 10.54,5.17 | 10.54,5.17 R12.1 11.12,4.9 11.43,5.21 11.43,7.72 11.51,7.8 12.28,7.8 R11.2 | R10.2 C20.1 12.51,8.92 R11.2 | 10.54,5.17 10.53,6.7 10.54,5.92 | 6.1,5.18 U4.8 6.1,5.2 | U4.13 8.88,5.92 8.25,5.92 | M1.VDD 16.19,5.36 | v11.58,8.19 v11.57,8.18 12.02,7.75 R11.2
  Top 0.305: LED_RGB.2 11.05,34.62 R8.2
  Top 0.61: U1.VIO_HOST 3.53,24.45 3.19,24.79 v3.19,28.75 3.19,29.26 | 3.19,29.26 3.19,31.93 4.15,32.89 C4.1 | U1.VBAT_IN 4.31,29.26 3.19,29.26
  $+3V3 0.203: 14.87,24.77 14.88,24.69 | 14.88,21.18 v14.8,20.88
  $+3V3 0.305: v14.87,28.69 14.87,24.77 | 14.88,24.69 14.88,21.18
  Bottom 0.203: U2.1 9.72,24.61 | 9.72,24.61 10.17,24.61 | 10.17,24.61 10.63,24.61 U2.48 | 10.17,24.61 10.17,23.33 C15.1 | U2.24 9.51,33.5 10.2,33.5 11.02,34.33 C13.1 11.25,35 | U2.36 16.26,30.19 C17.1 | 9.72,24.61 9.66,24.67 v9.65,25.35 | U2.36 14.87,29.77 v14.87,28.7 | P1.VDD P1.VCCA 6.81,8.4 6.81,7.98 6.96,7.87 7.62,7.87 | 7.94,8.19 7.62,7.87 | 7.62,7.87 7.63,7.87 7.96,8.2 10.92,8.2 v11.58,8.19 | v11.57,8.18 11.63,8.5 12.83,9.69 12.83,14.75 | U2.36 14.88,29.77 14.88,28.7 v14.87,28.69 | 14.08,38.67 14.44,39.03 16.65,39.03 16.89,39.27 17.94,39.27 JP2.1
  Bottom 0.254: P1.VDD_IO 7.94,8.19 | 12.83,14.75 U3.8
  Bottom 0.305: R7.1 3.15,35.26 v2.91,35.26 | Q1.3 3.35,39.71 v2.81,40.26
  Bottom 0.406: 11.25,35 12.17,35 v12.19,34.98
  Bottom 0.508: U3.7 U3.8 12.84,17.27 12.2,17.91 v12.2,18.03 11.61,18.03 11.35,17.78 R9.2 C8.1 | v14.8,20.88 15.38,21.46 U3.3
  Bottom 0.813: C2.1 7.12,37.97 7.86,37.24 IC1.3 7.86,35.76 v8.09,35.54 | L2.1 18.34,41.11 JP2.1
  pour $+3V3: 0.22,12.27 0.22,2.53 20.23,2.55 20.21,12.17
  pour $+3V3: 0.12,44.53 0.12,11.28 20.37,11.28 20.37,44.53
A0  (via drill 0.3)
  Top 0.254: M1.CLK 17.17,8.69 v17.26,8.74
  $GND 0.203: v4.1,9.31 4.1,4.86 13.18,4.86 15.11,6.8 15.11,7.6 M1.CLK 17.45,8.69 v17.26,8.74
  $GND 0.254: v17.26,8.74 17.44,8.71
  $+3V3 0.254: v4.1,9.31 4.1,9.63 JP1.12
  Bottom 0.203: U2.10 5.18,26.44 4.71,26.44 4.18,25.91 4.18,23.16 3.75,22.73 3.75,19.02 3.24,18.52 3.24,16.51 2.53,15.8 2.53,14.38 1.28,13.13 JP1.12
A1  (via drill 0.3)
  Top 0.254: M1.DOUT 17.31,7.04 v17.31,7.06
  $GND 0.203: 3.45,11.29 3.45,4.03 13.19,4.03 M1.DOUT 17.29,7.04 v17.31,7.06
  $GND 0.254: v17.31,7.06 17.37,7.06 | 3.45,11.29 v3.49,11.33
  $+3V3 0.254: v3.49,11.33 3.49,11.39 2.63,12.26 2.63,13.64 JP1.11
  Bottom 0.203: U2.11 4.88,26.85 4.53,26.85 3.77,26.09 3.77,23.34 3.34,22.91 3.34,19.28 2.53,18.47 2.53,16.92 1.28,15.67 JP1.11
A2
  Bottom 0.203: U2.14 6.05,29.9 6.29,29.9 6.67,29.52 6.67,28.96 6.29,28.58 5.24,28.58 3.77,27.1 3.77,26.65 3.37,26.24 3.37,23.52 2.93,23.09 2.93,19.86 1.28,18.21 JP1.10
A3
  Bottom 0.203: U2.15 5.41,31.24 4.97,31.24 4.33,30.61 4.33,28.3 3.37,27.33 3.37,26.8 2.96,26.39 2.96,23.7 2.53,23.27 2.53,22 1.28,20.75 JP1.9
A4
  Bottom 0.203: 6.1,31.25 U2.16 5.61,31.75 4.84,31.75 3.9,30.81 3.9,28.5 2.96,27.56 2.96,26.95 2.55,26.54 2.55,23.88 JP1.8
A5
  Bottom 0.203: U2.17 5.81,32.26 4.71,32.26 2.96,30.51 2.96,29.46 2.55,29.06 2.55,27.1 1.28,25.83 JP1.7
A6  (via drill 0.3)
  Top 0.203: R12.2 9.26,4.38 v9.28,3.33
  Top 0.254: R12.2 8.39,4.9 U4.12
  $GND 0.203: JP1.6 1.28,27.51 2.86,25.93 2.86,6.4 JP4.1 1.94,4.83 3.17,3.59 8.98,3.58 v9.28,3.33
  $GND 0.254: JP4.1 1.21,4.9
  Bottom 0.203: U2.18 6.03,32.74 4.56,32.74 2.55,30.73 2.55,29.64 1.28,28.37 JP1.6
A7
  Bottom 0.203: U2.19 6.28,33.2 4.33,33.2 1.36,30.23 JP1.5
BTN  (via drill 0.3)
  Top 0.203: 5.85,35.07 BTN.3 5.88,35.07 5.88,34.29 6.14,34.03 v6.61,34.03
  Bottom 0.203: U2.20 6.61,33.58 v6.61,34.03
D0  (via drill 0.3)
  Top 0.203: 5.59,9.17 5.49,9.17 v4.88,10.02 3.94,10.02 JP4.2
  Top 0.254: v11.01,11.72 R10.1 11.03,10.38 11.05,11.51 v4.97,11.51 | 5.59,9.17 U4.24
  $GND 0.254: v4.97,11.51 4.88,11.42 v4.88,10.02
  $+3V3 0.203: JP2.12 19.06,13.12 18.97,13.21 18.97,13.23 17.89,14.31 14.5,14.31 11.91,11.72 v11.01,11.72
  Bottom 0.203: JP2.12 19.06,13.13 17.79,14.4 17.79,15.49 14.11,19.18 14.11,19.81 13.47,20.45 13.47,23.24 13.6,23.37 13.6,25.17 U2.43
D1  (via drill 0.3)
  Top 0.203: U4.23 v6.1,10.75
  Top 0.254: v6.1,10.75 5.56,10.73 2.06,10.74 JP4.3 | v12.29,5.51 12.29,6.51 R11.1 12.51,5.6 v12.34,5.44 12.32,5.46
  $GND 0.203: 6.11,10.59 6.11,10.79 6.35,11.04 12.13,11.04 12.23,10.94
  $GND 0.254: v6.1,10.75 6.11,10.59 | JP2.11 18.96,15.09 15.28,15.09 12.34,12.15 12.34,10.95 | v12.34,5.44 12.34,10.95 | 12.34,10.95 12.23,10.94
  Bottom 0.203: U2.42 16.01,23.47 16.01,18.69 19.06,15.65 JP2.11
D2
  Bottom 0.203: U2.41 17.28,22.91 17.28,21.84 17.79,21.34 17.79,19.56 19.06,18.29 JP2.10
D3  (via drill 0.3)
  $+3V3 0.203: JP2.9 18.97,20.03 17.93,20.03 17.91,18.26 17.88,15.25 14.35,15.25 v11.85,12.75
  Bottom 0.203: U2.40 17.78,23.11 17.79,23.11 17.79,22.1 19.06,20.83 JP2.9 | P1.INT1 5.24,7.19 | 5.24,7.19 5.16,7.18 5.14,8.48 5.56,8.89 6.96,8.88 | 5.24,7.19 5.03,7.16 5.03,8.76 5.23,8.88 6.96,8.88 | 6.96,8.88 6.98,8.85 6.98,9.49 7.06,9.64 | v11.85,12.75 11.85,10.21 11.29,9.64 7.73,9.64 6.96,8.88
D4  (via drill 0.3)
  $+3V3 0.203: v10.91,12.76 14.05,15.9 16.61,15.9 16.61,22.62 16.62,22.61 JP2.8
  Bottom 0.203: U2.39 19,22.61 JP2.8 | P1.INT2 4.99,6.19 | 4.99,6.19 4.79,6.2 4.79,8.88 5.23,9.26 6.64,9.26 | 6.64,9.26 6.67,9.35 6.67,10.55 8.88,12.76 v10.91,12.76 | 4.99,6.19 4.69,6.22 4.69,8.94 5,9.26 6.64,9.26 | 6.64,9.26 6.67,9.23
D5  (via drill 0.3)
  $+3V3 0.203: v9.72,7.39 9.72,9.12 8.9,9.93 8.9,12.28 13,16.38 16.12,16.38 16.12,18.63 16.13,18.63 16.13,24.87 16.28,25.02 18.94,25.02 JP2.7
  Bottom 0.203: P1.SCL/SPC 8.44,6.69 9.13,7.38 9.7,7.38 v9.72,7.39
  Bottom 0.254: U2.38 14.96,27.37 16.8,25.53 18.58,25.53 | 18.58,25.53 18.68,25.53 JP2.7 | 18.58,25.53 19.09,25.02
D6  (via drill 0.3)
  $+3V3 0.203: 15.65,26.44 17.84,26.44 17.84,26.47 JP2.6 | 15.57,26.44 15.65,26.44 | 15.65,26.44 15.52,26.45 15.52,16.79 12.73,16.79 8.18,12.24 8.18,8.12 v7.28,7.21
  Bottom 0.203: U2.37 16.6,26.42 17.79,26.42 | 17.79,26.42 JP2.6 | 17.79,26.42 17.82,26.42 19.13,27.72 | v7.28,7.21 7.34,7.21 P1.SDA/SDI/SDO
  Bottom 0.254: 16.6,26.42 17.81,26.42 19.1,27.71
D7
  Bottom 0.203: U2.34 15.07,31.36 17.68,31.36 | RN1.5 17.87,33.82 18.05,33.64 18.05,31.73 17.68,31.36 | JP2.5 18.81,30.23 17.68,31.36
GND  (via drill 0.3)  (42 unrouted)
  Top 0.203: U1.GND@43 16.02,16.76 | U1.GND@1 15.41,18.45 | U1.GND@34 U1.GND@33 U1.GND@32 U1.GND@31 8.37,17.04 | U1.GND@22 U1.EXT_32K | U1.GND@45 U1.GND@18 | U1.GND@38 12.42,23.75 | U1.GND@25 4.5,22.23 3.95,22.23 3.31,21.59 3.31,17.02 3.7,16.64 4.28,16.64 U1.GND@46 | U1.GND@11 U1.GND@44 17.35,31.1 | U1.EXT_32K U1.GND@20 | U1.EXT_32K 7.42,26.85 | 7.42,26.85 U1.GND@42 | U1.GND@18 5.98,31.11 | 8.27,30.61 8.27,30.99 U1.GND@16 8.14,31.33 8.14,31.88 7.91,32.11 6.85,32.11 | U1.GND@18 5.97,31.84 6.24,32.11 6.85,32.11 | 6.85,32.11 6.83,32.12 C4.2 7.28,33.34 7.28,34.37 6.77,34.87 v6.77,35.51 | 7.62,3.61 7.62,5.02 | 7.61,5.27 7.61,5.68 7.24,6.05 6.73,6.05 | 6.73,6.05 6.6,5.92 U4.9 | U4.11 7.61,3.96 | 6.73,6.05 6.73,4.74 6.44,4.45 3.75,4.45 3.75,8.42 4.64,8.42 U4.1 | 6.06,8.44 U4.18 8.86,8.73 v8.85,9.03 | 6.06,8.44 U4.1 | v6.24,7.71 6.22,8.43 6.06,8.44 | U4.15 9.24,6.94 v9.79,6.57 | C18.2 10.68,8.74 C20.2 | 17.77,28.98 v17.79,28.96 | 12.08,25.91 12.08,27.2 U1.GND@39 | 7.42,26.85 9.75,26.85 v9.73,26.71
  Top 0.254: 7.89,3.62 7.62,3.61 | 7.62,5.02 U4.11 7.61,5.27 7.62,5.28 | 6.6,5.03 6.61,5.03 U4.9 | v9.8,10.24 C19.2 v9.86,10.24 | 4.84,8.46 U4.1 | 7.61,3.96 C21.2 | M1.GND1 18.54,5.35 18.52,5.32 18.44,5.32 18.43,5.33 18.54,5.33
  Top 0.406: X1.GND 8.87,43.15 v9.16,43.43 | 13.22,33.19 13.22,33.86 v13.31,33.95
  Top 0.508: 13.22,33.19 C7.1
  Top 0.61: U1.GND@1 v17.36,18.45 v17.36,18.44 | U1.GND@9 U1.GND@10 16.31,28.96 v17.79,28.96 | 13.09,42.79 X1.MT1 C16.C | BTN.2 2.27,38.83 JP1.2 | RESET.4 C1.2 | C1.2 16.04,40.55 15,41.59 C16.C | C1.2 17.01,39.88 v17.13,40.01 | LED_USR.C 15.39,43.32 C16.C
  $+3V3 0.254: v9.86,10.24 v9.86,12.14
  Bottom 0.203: 14.95,30.55 U2.35 15.39,30.99 17.46,30.99 17.79,30.66 v17.79,28.96 17.79,28.32 17.58,28.11 C17.2 | U2.47 12.26,23.69 12.26,23.06 11.67,22.48 C15.2 | 8.17,34.82 7.45,34.82 v6.77,35.51 | U2.23 8.17,34.15 8.17,34.82 | C14.2 5.09,23.6 5.91,24.41 5.91,25.75 U2.8 6.48,26.3 6.95,26.77 9.68,26.77 v9.73,26.71 | 8.17,34.82 8.92,34.82 C13.2 | U2.44 12.24,25.83 v12,25.83 | P1.GND1 P1.GND2 P1.GND1 v6.24,7.71 | v8.85,9.03 7.92,9.02 P1.GND3 | v9.79,6.57 9.8,6.53 9.77,6.18 P1.GND 8.12,6.14 8.12,5.45 8.08,5.41 7.07,5.41 6.82,5.66 6.82,6.05 6.84,6.02 P1.SDO/SA0 | B1.GND 16.04,37.54 16.5,37.08 17.13,37.08 17.41,37.36 17.84,37.36 18.28,36.93 18.28,36.27 17.82,35.81 17.82,34.67 18.62,33.87 18.62,33.21 JP2.4
  Bottom 0.254: 9.88,10.16 v9.8,10.24
  Bottom 0.305: 10.17,43.31 IC1.4 | Q1.1 6.38,39.71 v6.74,40.08 | C2.2 4.73,37.11 6.36,37.11 6.77,36.7 v6.77,35.51
  Bottom 0.406: R2.1 0.83,43.05 v0.83,42.06
  Bottom 0.508: U3.4 16.65,19.15 v17.36,18.44 | v11.95,21.64 11.21,21.64 11.02,21.83 C15.2 | 0.83,43.04 R2.1
  Bottom 0.61: C8.2 C10.2 C9.2 C12.2 C11.2 3.71,14.14 3.31,14.53 3.31,15.27
  Bottom 0.813: 10.17,43.43 IC1.4 | v17.13,40.01 16.17,40.01 C1.2
  Bottom 1.27: IC1.2 IC1.4 | 7.38,42.93 X1.MT1 C16.C
  other vias: 11.19,43.43 1.92,2.87 4.71,2.87 7.51,2.87 10.3,2.87 13.09,2.87 16.78,2.87 19.57,2.87
  pour Top (no thermals): 2.93,11.1 3.06,33.27 17.28,33.27 17.16,11.1
  pour Bottom (no thermals): 2.24,44.26 18.06,44.23 18.12,2.51 2.3,2.54
  pour Top: 2.53,11.6 2.65,2.5 20.19,2.54 20.28,11.57
  pour Top: 0.17,4.03 0.22,4.03 0.22,2.46 3.99,2.46 3.99,4.05 0.18,4.05
  pour Bottom: 0.12,44.53 20.37,44.53 20.37,41.53 0.12,41.53
  pour Bottom: 0.39,3.86 0.37,2.49 20.19,2.49 20.22,11.38 17.69,11.38 17.69,4.39 0.39,4.39
  pour Top: 0.12,44.53 20.37,44.53 20.37,10.53 0.12,10.53
  pour $GND: -0.13,44.53 -0.13,2.53 20.37,2.53 20.37,44.53
LED1  (via drill 0.3)
  Top 0.203: LED_USR.A 17.36,43.05 17.36,41.33 17.88,40.8 17.86,40.78 17.86,36.92 17.56,36.63 v17.55,36.63
  Bottom 0.203: RN1.4 17.25,36.33 v17.55,36.63
LED2
  Bottom 0.203: U2.29 13.61,33.45 14.33,33.45 RN1.8
LED3
  Bottom 0.203: U2.30 13.21,32.31 13.8,32.91 13.8,32.92 13.94,33.06 15.38,33.06 15.54,33.22 15.54,33.79 RN1.7
LED4
  Bottom 0.203: U2.31 13.56,31.96 14.19,32.59 15.48,32.59 16.2,33.31 16.2,33.65 RN1.6
MEM_CS
  Bottom 0.203: U2.46 12.84,23.81 U3.1
  Bottom 0.305: U3.1 12.84,20.14 12.34,19.65 R9.1
N$1
  Top 0.305: R3.1 7.1,40.82 7.51,40.41 R5.2 7.57,39.06 9.99,39.06 10.17,39.24 X1.D+
N$3
  Top 0.61: L3.1 14.38,3.99 C3.2 14.47,1 ANT1.SIG
N$4
  Top 0.61: X2.1 14.68,12.07 | U1.RF_ANT 13.17,13.38 X2.1 | X2.1 14.72,11.6 14.36,11.25 14.36,7.59 L3.2
N$6
  Top 0.254: R6.2 12.65,38.95 12.53,39.06 11.19,39.06 10.87,39.38 10.87,40.2 X1.D-
N$7
  Top 0.203: U1.SCL_CC3000 U1.SCL_EEPROM
N$8
  Bottom 0.305: Q1.2 4.71,39.01 4.53,38.84 3.16,38.84 2.93,38.61 2.93,36.45 3.19,36.2 R4.2
N$9
  Top 0.203: U1.WL_EN1 16.78,25.65 17.03,25.4 17.03,23.62 16.78,23.37 16.14,23.37 U1.WL_EN2
N$10  (via drill 0.3)
  Top 0.203: LED_RGB.1 9.27,35.56 9.39,35.67 12.51,35.67 12.76,35.42 13.5,35.42 v13.58,35.34
  Bottom 0.203: 14.6,35.42 RN1.1 14.68,35.34 v13.58,35.34
N$11
  pour Top: 17.92,44.2 20.33,44.2 20.33,41.78 17.92,41.78
N$12  (via drill 0.3)
  Top 0.203: LED_RGB.3 11.07,36.73 11.39,36.41 14.17,36.41 v14.57,36.8
  Bottom 0.203: RN1.2 15.58,35.76 15.37,35.97 15.15,35.97 14.8,36.32 14.8,36.58 v14.57,36.8
N$13
  Bottom 0.254: Q1.5 4.71,42.09 3.98,42.82 R1.1 2.59,42.98 R2.2
  Bottom 0.305: Q1.5 Q1.6
N$14  (via drill 0.3)
  Top 0.203: LED_RGB.4 9.27,36.71 9.93,36.05 15,36.05 v15.52,36.58
  Bottom 0.203: RN1.3 16.38,36.32 16.27,36.42 15.67,36.42 v15.52,36.58
N$15
  Top 0.203: U1.SDA_EEPROM U1.SDA_CC3000
N$16  (via drill 0.3)
  Top 0.305: 3.77,40.82 R3.2 3.79,40.89 3.21,40.89 2.86,41.25 v2.68,41.25
  Bottom 0.305: Q1.4 3.99,41.25 v2.68,41.25
N$17
  Top 0.254: C19.1 7.6,9.06 U4.20
N$18
  Top 0.203: 7.11,5.06 7.11,3.62
  Top 0.254: U4.10 7.11,5.06 | 7.11,3.62 C21.1
OSC32_IN
  Bottom 0.203: U2.3 7.58,23.89 7.58,23.52 8.34,22.76 8.34,20.9 8.45,20.8 8.78,20.8 Y1.X1 10.12,20.55 10.32,20.34 10.32,17.42 9.54,16.64 C10.1
OSC32_OUT
  Bottom 0.203: U2.4 7.15,24.17 7.15,23.34 7.76,22.73 7.76,18.05 | 7.76,18.05 7.76,15.96 C9.1 | Y1.X2 7.76,18.05
OSC_IN
  Bottom 0.203: U2.5 6.74,24.47 6.74,21.67 Y2.1 6.88,20.23 5.75,19.1 5.75,16.99 6.24,16.51 C12.1
OSC_OUT
  Bottom 0.203: U2.6 6.31,24.74 6.31,23.06 5.75,22.5 5.75,20.24 4.58,19.07 Y2.3 | Y2.3 | Y2.3 C11.1
RAW  (via drill 0.3)  (1 unrouted)
  Top 0.61: U$3.CATHODE 2.86,42.88 1.33,41.35 1.33,40.44 JP1.1
  $+3V3 0.61: JP1.1 1.78,40.88 1.78,42.05 1.8,42.08 4.2,42.08 4.75,41.53 4.75,39.94 5.89,38.8 7.53,38.8 8.46,39.73 13,39.73 v14.22,40.95
  Bottom 0.61: v14.27,40.95 14.27,39.88 14.31,39.84 12.95,39.84 12.66,39.55 12.66,37.21 IC1.1
  Bottom 0.813: C1.1 14.34,40.83 v14.22,40.95
RX  (via drill 0.3)
  $+3V3 0.305: v3.34,33.43 3.34,31.9 v6,29.23
  Bottom 0.203: U2.13 v6,29.23
  Bottom 0.305: v3.34,33.43 2.68,32.77 JP1.4
SPI_DOUT  (via drill 0.3)
  Top 0.203: U1.SPI_DOUT 11.97,30.68 11.35,30.06 10.92,30.06 v10.79,29.93 | U1.SPI_DOUT 12.02,31.1 12.12,31.19 | U1.SPI_DOUT 11.97,30.8
  $+3V3 0.203: v16.8,37.67 16.8,35.94 v10.79,29.93
  Bottom 0.203: v16.79,37.69 16.45,38.04 B1.IN 16.43,38.04 v16.8,37.67
SPI_MISO  (via drill 0.3)
  $+3V3 0.305: v14.22,23.3 14.22,24.85 12.27,26.81 12.27,29.55 v12.14,29.68
  Bottom 0.203: B1.OUT 13.55,37.54 13.49,37.48 13.49,36.13 12.94,35.59 12.94,34.86 12.62,34.54 12.62,33.88 U2.27 11.56,32.81 11.56,30.95 12.04,30.47 12.04,29.78 v12.14,29.68 12.05,29.77
  Bottom 0.305: U3.2 14.11,23.19 v14.22,23.3
SPI_MOSI  (via drill 0.3)
  Top 0.203: 9.39,30.91 9.39,30.66 9.26,30.66 8.7,30.1 8.25,30.1 8.13,29.97 8.13,29.06 8.38,28.8 9.66,28.8 9.86,28.61 9.86,28.07 v9.84,28.05
  Top 0.305: U1.SPI_DIN 9.39,30.91
  $+3V3 0.305: v14.19,18.16 8.9,23.44 8.9,27.81 9.16,28.07 9.83,28.07 v9.84,28.05
  Bottom 0.203: U2.28 12,32.55 12,31.04 12.03,31.04 12.94,30.12 12.94,29.44 12.05,28.55 12.05,28.21 11.79,27.94 9.96,27.94 v9.84,28.05 9.87,28.08
  Bottom 0.305: U3.5 16.65,15.7 v14.19,18.16
SPI_SCK  (via drill 0.3)
  Top 0.305: U1.SPI_CLK 7.17,30.15 v7.39,29.93
  $+3V3 0.305: v13.12,18.16 8.27,23.01 8.27,29.06 v7.39,29.93
  Bottom 0.203: U2.26 11.14,33.1 11.14,30.71 11.48,30.37 11.48,28.49 11.38,28.38 10.52,28.38 10.12,28.78 8.55,28.78 v7.39,29.93
  Bottom 0.305: U3.6 15.38,15.9 v13.12,18.16
TX  (via drill 0.3)
  $+3V3 0.254: 4.13,32.26 4.13,31.93 4.43,31.93 v7.31,29.05
  $+3V3 0.305: v2.81,34.19 3.7,34.19 4.13,33.76 4.13,32.26
  Bottom 0.203: U2.12 5.5,28.17 6.49,28.17 7.35,29.03 v7.31,29.05
  Bottom 0.305: v2.81,34.19 1.69,35.31 JP1.3
USB_DISC
  Bottom 0.203: U2.21 7.28,33.62 7.28,34.37 6.95,34.7 5.71,34.7 R7.2 R4.1
USBM  (via drill 0.3)
  Top 0.203: 12.88,37.34 R6.1 13.75,37.2 14.02,37.47 15.58,37.47 16.36,36.69 16.36,36.2 16.4,36.16 16.4,36.13 16.84,35.69 16.84,33.95 16.36,33.46 16.36,32.47 v16.41,32.6
  Bottom 0.203: U2.32 13.88,31.63 14.39,32.13 14.4,32.13 14.45,32.18 16.07,32.18 16.07,32.26 v16.41,32.6
USBP  (via drill 0.3)
  Top 0.203: 7.43,37.17 R5.1 7.51,37.54 8.56,38.59 11.63,38.59 12.14,38.09 13.78,38.09 14,37.87 15.72,37.87 16.83,36.77 16.83,36.35 17.4,35.78 17.4,33 v17.26,32.91
  Bottom 0.203: U2.33 14.81,31.83 16.99,31.83 17.26,32.09 v17.26,32.91
UVCC  (via drill 0.3)
  Top 0.305: 11.47,40.15 X1.VBUS
  Top 0.406: 13.04,41.22 v13.08,41.16 | X1.VBUS 11.47,39.92 11.48,39.92
  Top 0.61: 5.21,42.85 5.21,42.71 | U$3.ANODE 5.21,42.85 | 11.48,39.92 12.69,39.92 13.11,40.34 13.11,41.13 v13.08,41.16 | 5.21,42.85 5.24,42.85 v6.18,41.91
  $+3V3 0.61: v6.18,41.91 6.08,42.1 6.54,41.64 12.6,41.64 v13.08,41.16
  Bottom 0.61: R1.2 5.68,42.91 | 5.96,42.7 R1.2 | v6.18,41.91 6.18,42.47 R1.2
VDDA  (via drill 0.3)
  $+3V3 0.203: 14.26,30.71 14.25,30.72 14.21,30.72 | 13.45,29.96 13.45,29.95
  $+3V3 0.254: 13.45,29.95 13.45,29.02 v13.35,28.92
  $+3V3 0.305: JP2.3 19.06,34.43 17.96,33.33 17.96,31.43 17.23,30.71 14.26,30.71 | 14.21,30.72 13.45,29.96
  $+3V3 0.406: 19.04,36.22 19.02,36.22 | 19.02,36.22 17.83,37.41 17.83,40.66 16.46,42.04 v16.38,42.04 | JP2.3 19.06,36.18 19.02,36.22
  Bottom 0.203: C14.1 5.42,25.56 5.42,25.97 U2.9 6.88,27.43 11.86,27.43 v13.35,28.92
  Bottom 0.406: L2.2 15.55,41.2 v16.38,42.04
  Bottom 0.61: L2.2 15.55,41.25 16.64,42.34 17.21,42.34 C16.A
WIFI_CS  (via drill 0.3)
  Top 0.203: U1.SPI_CS 12.93,31.34 | 12.84,30.76 12.84,29.5 12.26,28.92 10.87,28.92 v10.74,29.07
  Top 0.254: 13.33,30.93 U1.SPI_CS 12.84,30.76
  $+3V3 0.203: v17.11,38.49 16.27,38.49 16.26,38.51 16.2,38.51 16.17,38.47 16.17,35.88 11.38,31.09 10.38,31.09 9.87,30.58 9.87,29.95 v10.74,29.07
  Bottom 0.203: U2.25 10.71,33.38 10.27,32.93 10.26,32.93 9.87,32.54 9.87,29.74 10.07,29.74 v10.74,29.07 | v17.11,38.52 17.09,38.54 B1./OE 17.06,38.54 v17.11,38.49
WIFI_EN  (via drill 0.3)
  Top 0.203: 4.34,20.83 U1.VBAT_SW_EN
  Top 0.305: U1.VBAT_SW_EN 5.34,20.85 6.54,22.05 9.51,22.05 10.43,22.96 10.43,25.4 v10.68,25.65
  Bottom 0.203: U2.45 12.14,25.22 11.11,25.22 v10.68,25.65
WIFI_INT  (via drill 0.3)
  Top 0.203: U1.SPI_IRQ 10.77,30.94 10.07,30.24 9.69,30.24 9.3,29.84 9.28,29.6 v9.08,29.59
  Bottom 0.203: U2.22 9.09,32.48 9.09,30.1 v9.08,29.59

### Text on the board
tPlace: VCC | RAW | RST | GND | VDDA | TX | BTN | RST | GND | RX | D7 | A7 | D6 | A6 | D5 | A5 | D4 | A4 | D3 | A3 | D2 | A2 | D1 | A1 | D0 | A0 | SCL | SDA | INT
bPlace: Kiwi Move Rev 2